# EAGLE design witch-phase2b (EAGLE 6.4)

## Sheet 1 of 6
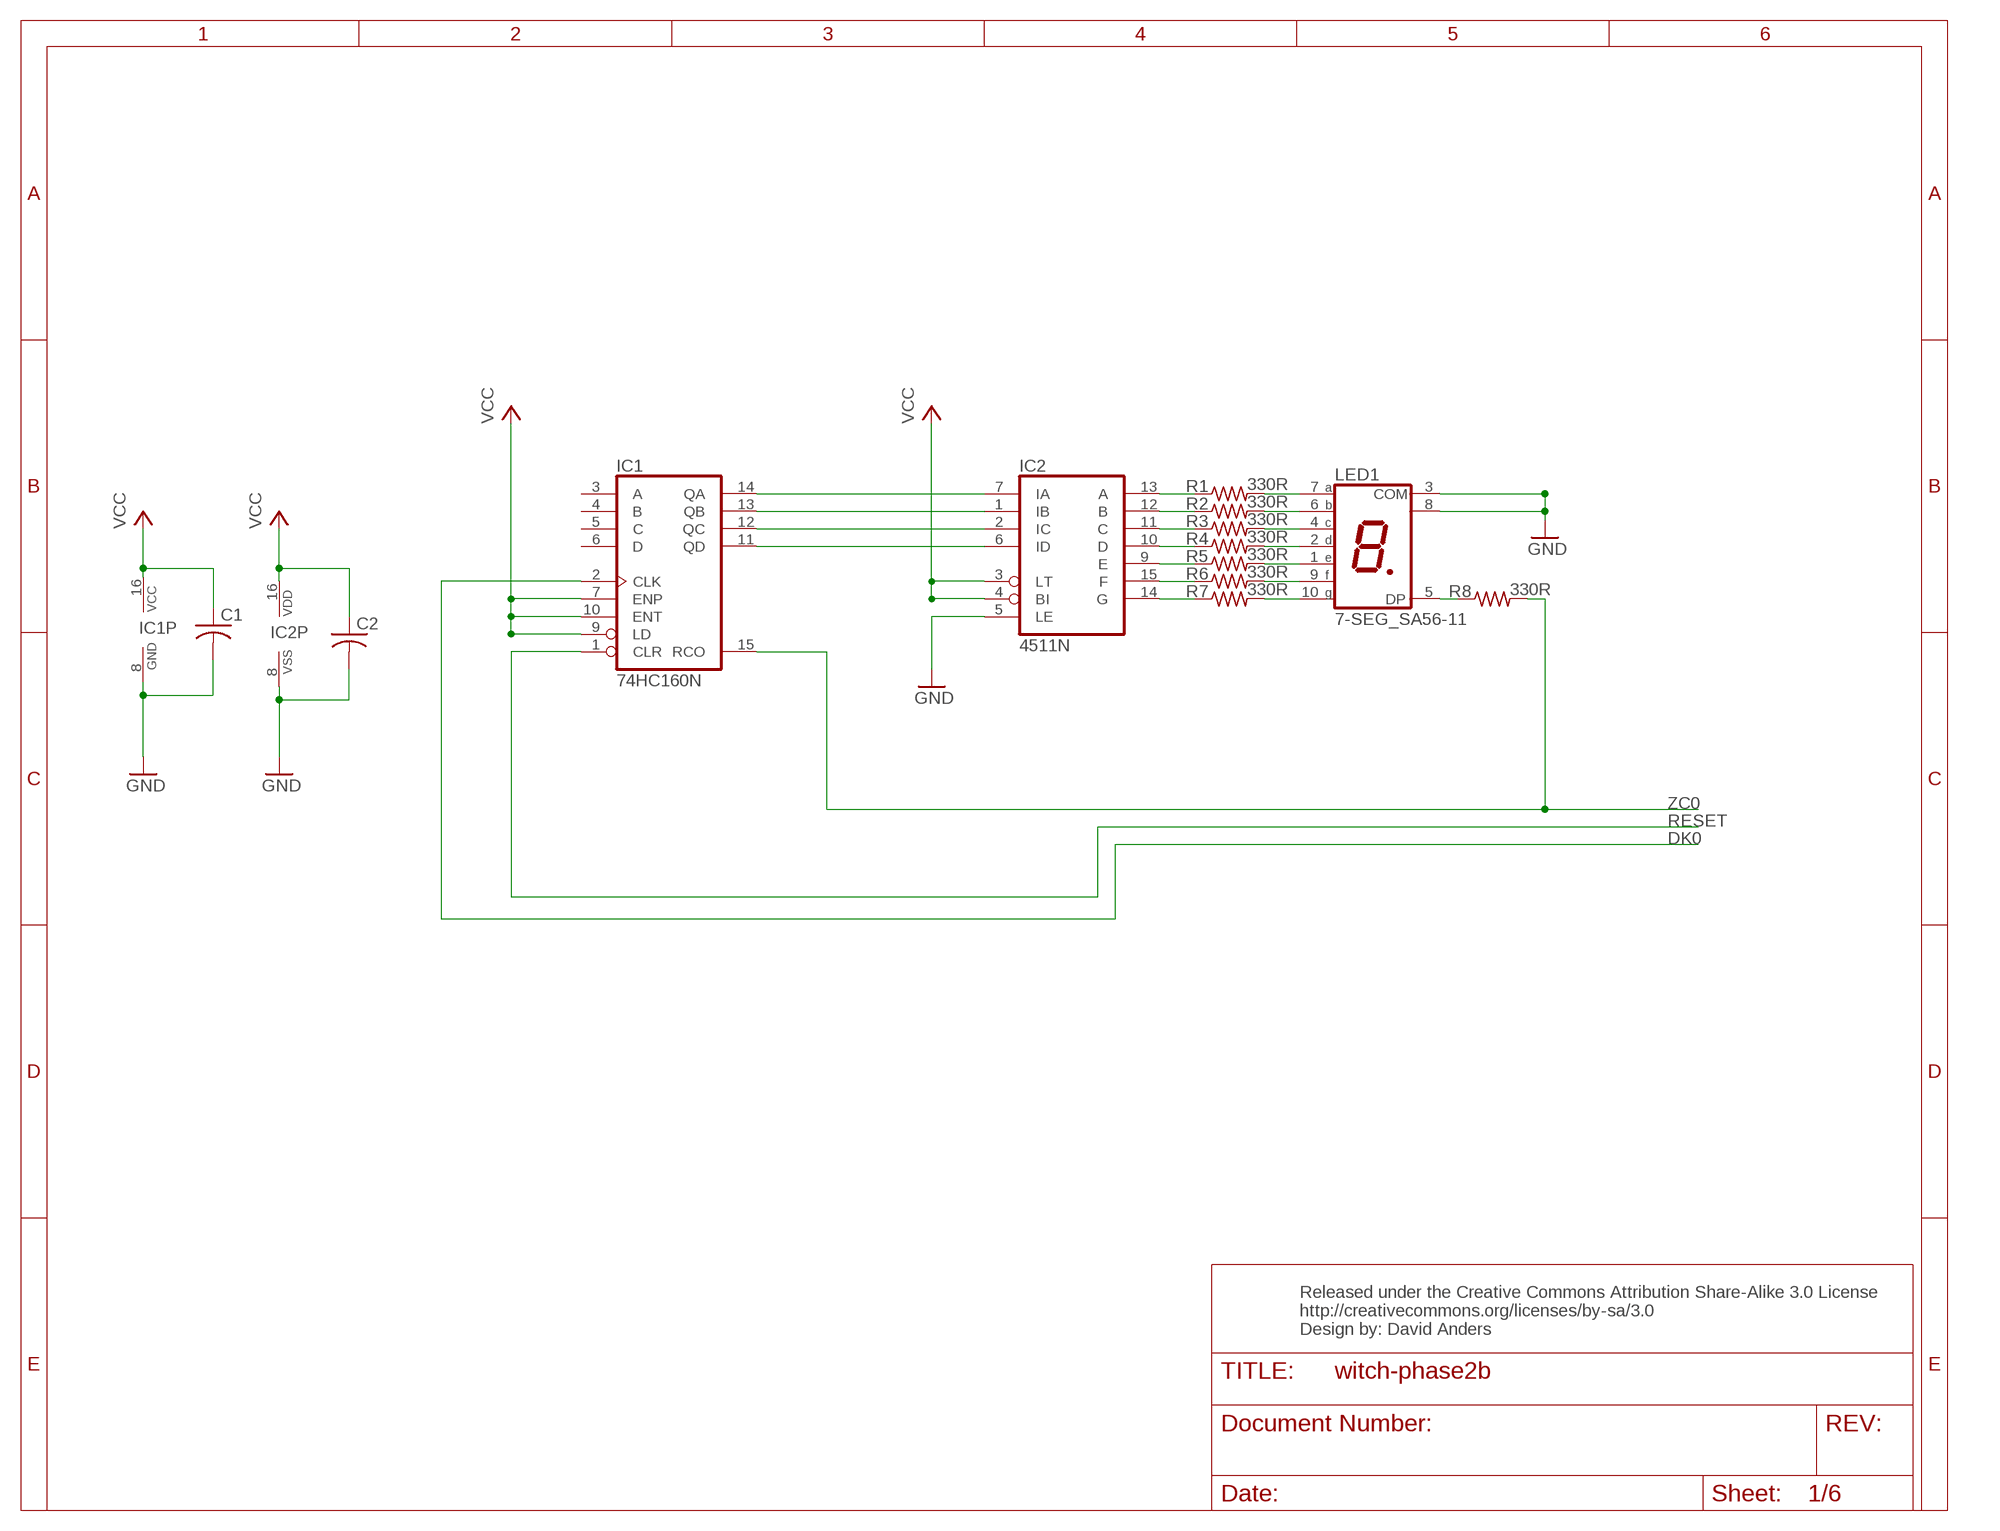
[diagram p0: schematic, sheet 1]

### Parts
C1  C-US025-025X050  [C025-025X050]
C2  C-US025-025X050  [C025-025X050]
IC1  74HC160N  [DIL16]
IC2  4511N  [DIL16]
LED1  7-SEG_SA56-11  [SA56-11]
R1  330R  R-US_0204/5  [0204/5]
R2  330R  R-US_0204/5  [0204/5]
R3  330R  R-US_0204/5  [0204/5]
R4  330R  R-US_0204/5  [0204/5]
R5  330R  R-US_0204/5  [0204/5]
R6  330R  R-US_0204/5  [0204/5]
R7  330R  R-US_0204/5  [0204/5]
R8  330R  R-US_0204/5  [0204/5]

### Nets
DK0: IC1.2(CLK) ; also sheet 5
GND: C1.2 C2.2 IC1.8(GND) IC2.5(LE) IC2.8(VSS) LED1.3(COM) LED1.8(COM) ; also sheet 2,3,4,5,6
N$3: IC2.13(A) R1.1
N$4: IC2.12(B) R2.1
N$5: IC2.11(C) R3.1
N$6: IC2.10(D) R4.1
N$7: IC2.9(E) R5.1
N$8: IC2.15(F) R6.1
N$9: IC2.14(G) R7.1
N$10: IC1.14(QA) IC2.7(IA)
N$11: IC1.13(QB) IC2.1(IB)
N$12: IC1.12(QC) IC2.2(IC)
N$13: IC1.11(QD) IC2.6(ID)
N$14: LED1.7(A) R1.2
N$15: LED1.6(B) R2.2
N$16: LED1.4(C) R3.2
N$17: LED1.2(D) R4.2
N$18: LED1.1(E) R5.2
N$19: LED1.9(F) R6.2
N$20: LED1.10(G) R7.2
N$21: LED1.5(DP) R8.1
RESET: IC1.1(CLR) ; also sheet 2,3,4,6
VCC: C1.1 C2.1 IC1.7(ENP) IC1.9(LD) IC1.10(ENT) IC1.16(VCC) IC2.3(LT) IC2.4(BI) IC2.16(VDD) ; also sheet 2,3,4,5,6
ZC0: IC1.15(RCO) R8.2 ; also sheet 5
Unconnected: IC1.3(A) IC1.4(B) IC1.5(C) IC1.6(D)

### Notes on the sheet
- Released under the Creative Commons Attribution Share-Alike 3.0 License
  http://creativecommons.org/licenses/by-sa/3.0
  Design by: David Anders

## Sheet 2 of 6
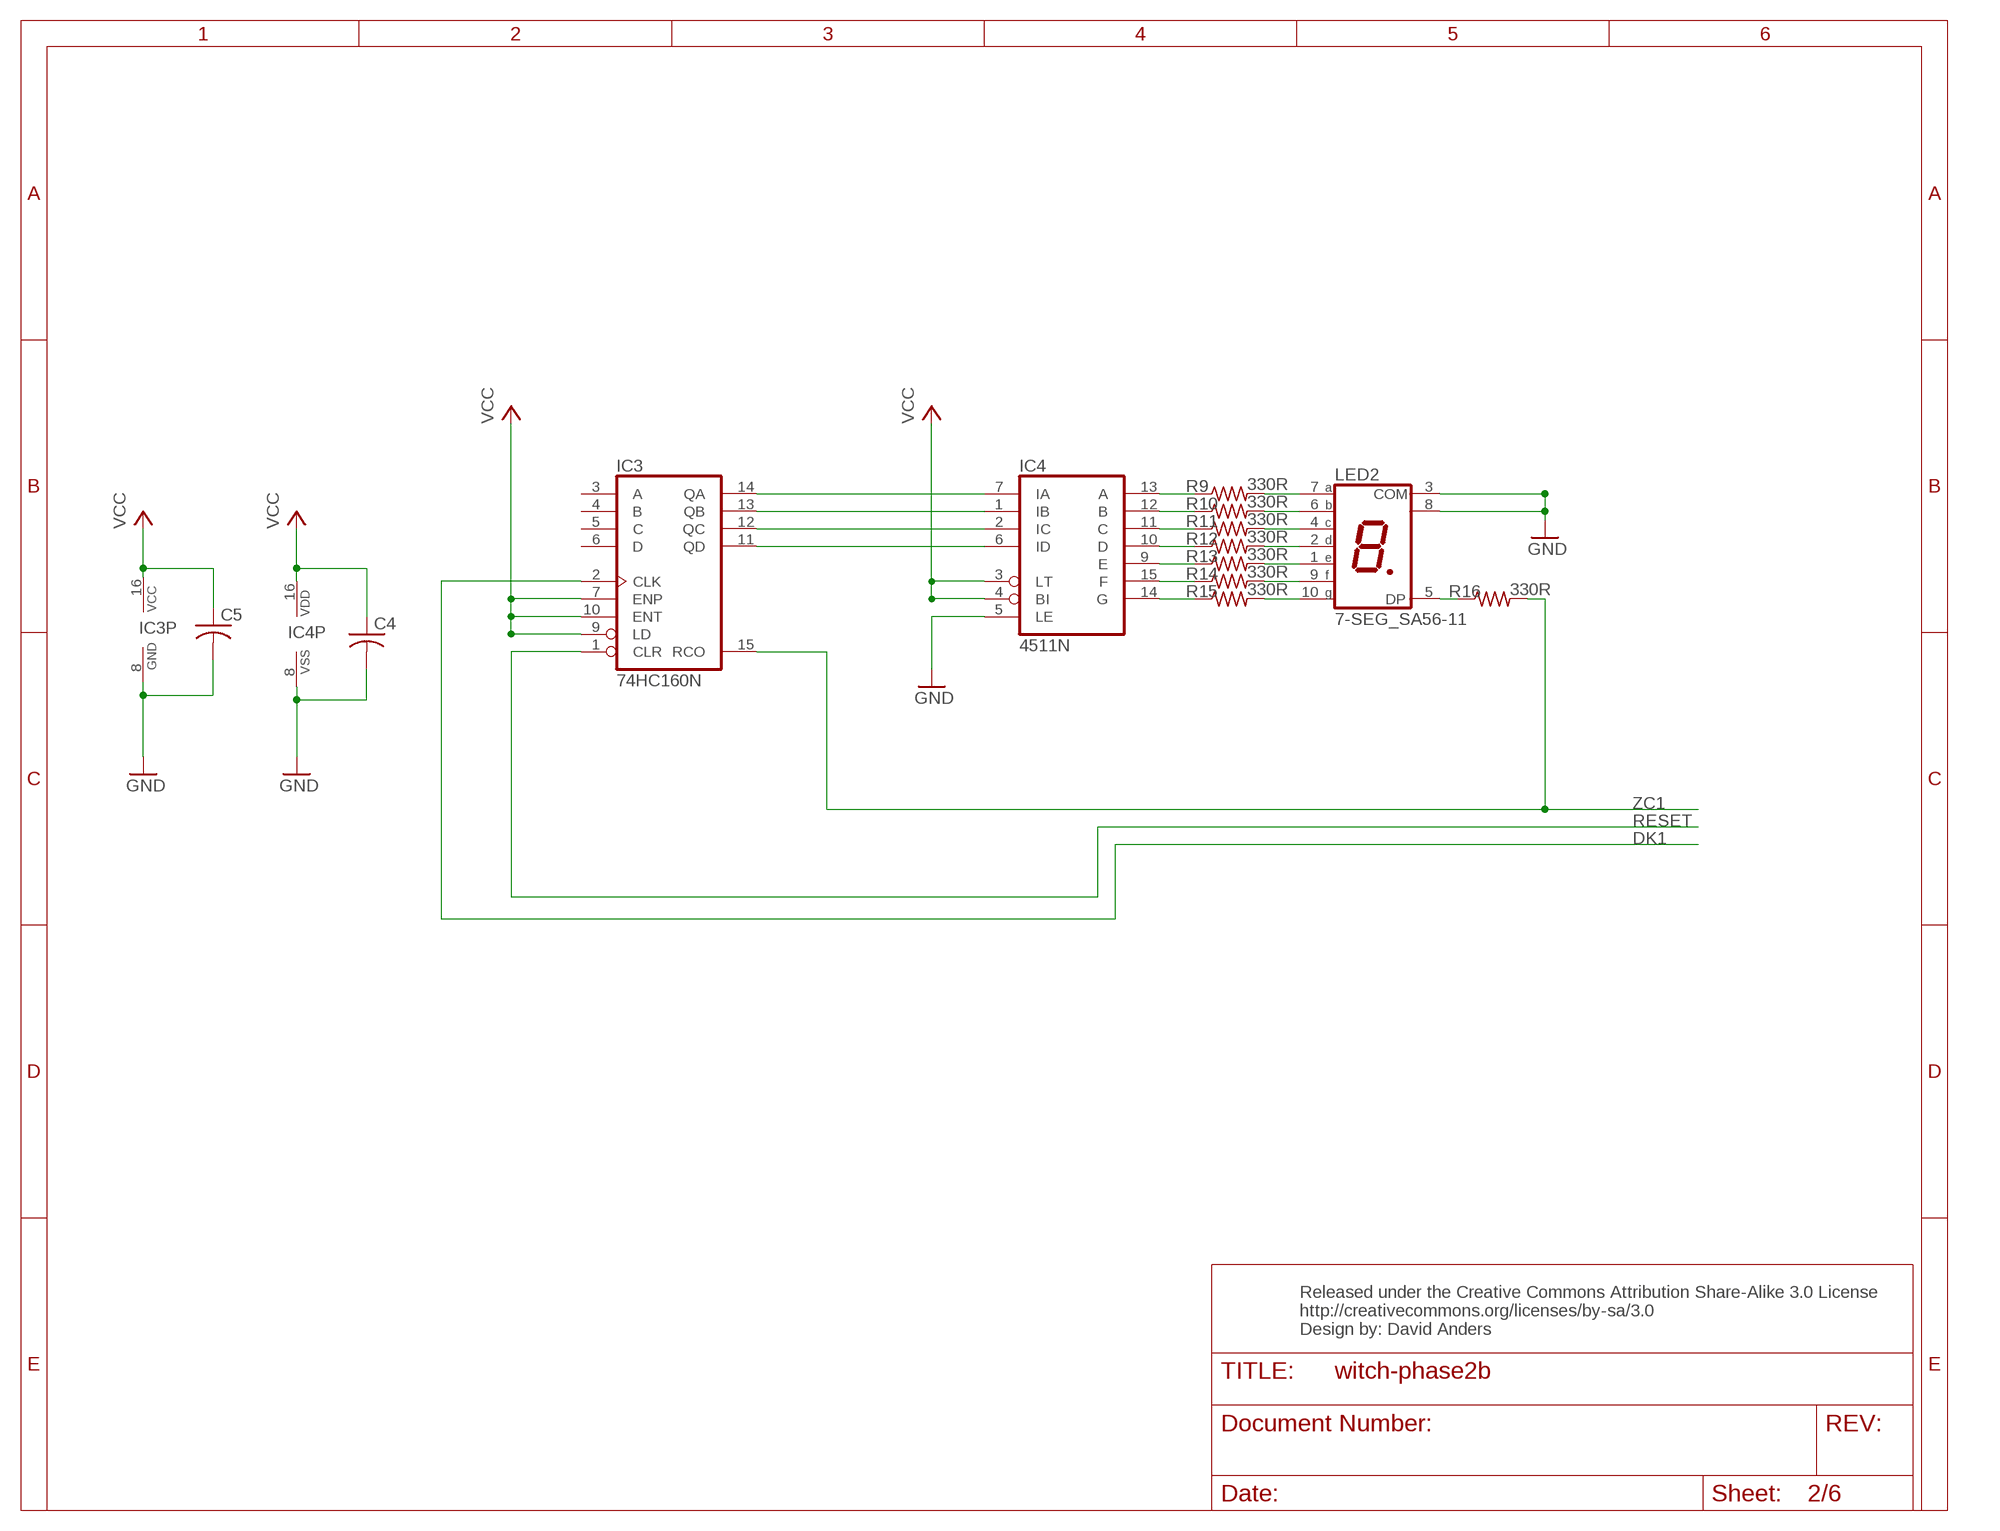
[diagram p1: schematic, sheet 2]

### Parts
C4  C-US025-025X050  [C025-025X050]
C5  C-US025-025X050  [C025-025X050]
IC3  74HC160N  [DIL16]
IC4  4511N  [DIL16]
LED2  7-SEG_SA56-11  [SA56-11]
R9  330R  R-US_0204/5  [0204/5]
R10  330R  R-US_0204/5  [0204/5]
R11  330R  R-US_0204/5  [0204/5]
R12  330R  R-US_0204/5  [0204/5]
R13  330R  R-US_0204/5  [0204/5]
R14  330R  R-US_0204/5  [0204/5]
R15  330R  R-US_0204/5  [0204/5]
R16  330R  R-US_0204/5  [0204/5]

### Nets
DK1: IC3.2(CLK) ; also sheet 5
GND: C4.2 C5.2 IC3.8(GND) IC4.5(LE) IC4.8(VSS) LED2.3(COM) LED2.8(COM) ; also sheet 1,3,4,5,6
N$22: IC3.14(QA) IC4.7(IA)
N$23: IC3.13(QB) IC4.1(IB)
N$24: IC3.12(QC) IC4.2(IC)
N$26: IC3.11(QD) IC4.6(ID)
N$30: IC4.13(A) R9.1
N$31: IC4.12(B) R10.1
N$32: IC4.11(C) R11.1
N$33: IC4.10(D) R12.1
N$34: IC4.9(E) R13.1
N$35: IC4.15(F) R14.1
N$36: IC4.14(G) R15.1
N$37: LED2.7(A) R9.2
N$38: LED2.6(B) R10.2
N$39: LED2.4(C) R11.2
N$40: LED2.2(D) R12.2
N$41: LED2.1(E) R13.2
N$42: LED2.9(F) R14.2
N$43: LED2.10(G) R15.2
N$44: LED2.5(DP) R16.1
RESET: IC3.1(CLR) ; also sheet 1,3,4,6
VCC: C4.1 C5.1 IC3.7(ENP) IC3.9(LD) IC3.10(ENT) IC3.16(VCC) IC4.3(LT) IC4.4(BI) IC4.16(VDD) ; also sheet 1,3,4,5,6
ZC1: IC3.15(RCO) R16.2 ; also sheet 5
Unconnected: IC3.3(A) IC3.4(B) IC3.5(C) IC3.6(D)

### Notes on the sheet
- Released under the Creative Commons Attribution Share-Alike 3.0 License
  http://creativecommons.org/licenses/by-sa/3.0
  Design by: David Anders

## Sheet 3 of 6
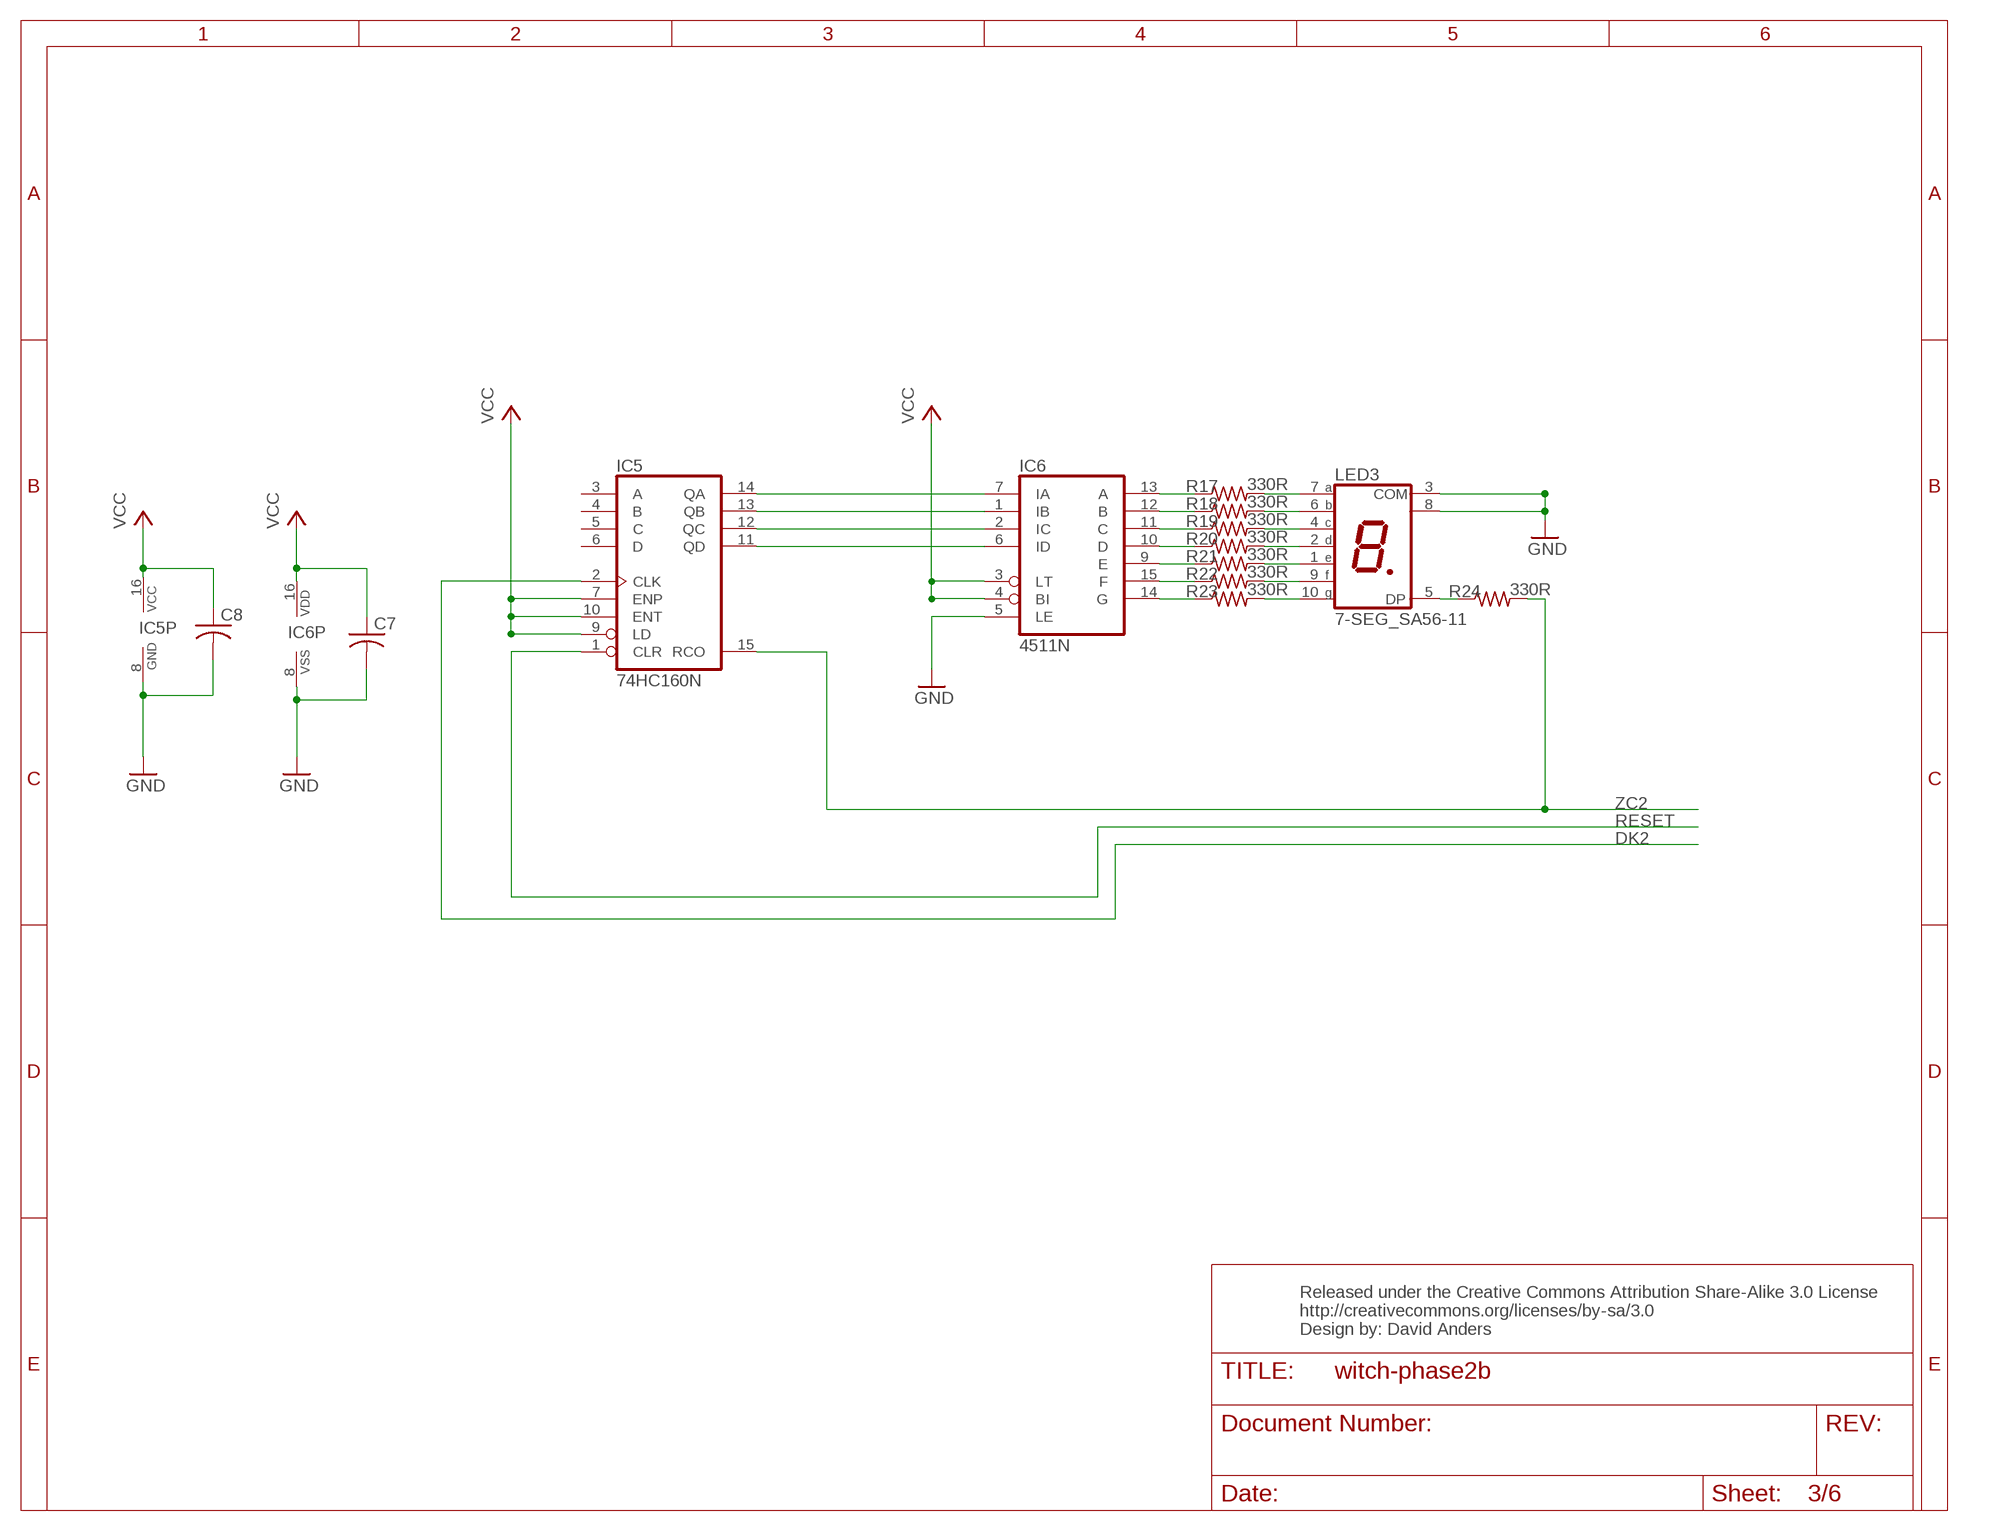
[diagram p2: schematic, sheet 3]

### Parts
C7  C-US025-025X050  [C025-025X050]
C8  C-US025-025X050  [C025-025X050]
IC5  74HC160N  [DIL16]
IC6  4511N  [DIL16]
LED3  7-SEG_SA56-11  [SA56-11]
R17  330R  R-US_0204/5  [0204/5]
R18  330R  R-US_0204/5  [0204/5]
R19  330R  R-US_0204/5  [0204/5]
R20  330R  R-US_0204/5  [0204/5]
R21  330R  R-US_0204/5  [0204/5]
R22  330R  R-US_0204/5  [0204/5]
R23  330R  R-US_0204/5  [0204/5]
R24  330R  R-US_0204/5  [0204/5]

### Nets
DK2: IC5.2(CLK) ; also sheet 5
GND: C7.2 C8.2 IC5.8(GND) IC6.5(LE) IC6.8(VSS) LED3.3(COM) LED3.8(COM) ; also sheet 1,2,4,5,6
N$45: IC5.14(QA) IC6.7(IA)
N$46: IC5.13(QB) IC6.1(IB)
N$47: IC5.12(QC) IC6.2(IC)
N$48: IC5.11(QD) IC6.6(ID)
N$52: IC6.13(A) R17.1
N$53: IC6.12(B) R18.1
N$54: IC6.11(C) R19.1
N$55: IC6.10(D) R20.1
N$56: IC6.9(E) R21.1
N$57: IC6.15(F) R22.1
N$58: IC6.14(G) R23.1
N$59: LED3.7(A) R17.2
N$60: LED3.6(B) R18.2
N$61: LED3.4(C) R19.2
N$62: LED3.2(D) R20.2
N$63: LED3.1(E) R21.2
N$64: LED3.9(F) R22.2
N$65: LED3.10(G) R23.2
N$66: LED3.5(DP) R24.1
RESET: IC5.1(CLR) ; also sheet 1,2,4,6
VCC: C7.1 C8.1 IC5.7(ENP) IC5.9(LD) IC5.10(ENT) IC5.16(VCC) IC6.3(LT) IC6.4(BI) IC6.16(VDD) ; also sheet 1,2,4,5,6
ZC2: IC5.15(RCO) R24.2 ; also sheet 5
Unconnected: IC5.3(A) IC5.4(B) IC5.5(C) IC5.6(D)

### Notes on the sheet
- Released under the Creative Commons Attribution Share-Alike 3.0 License
  http://creativecommons.org/licenses/by-sa/3.0
  Design by: David Anders

## Sheet 4 of 6
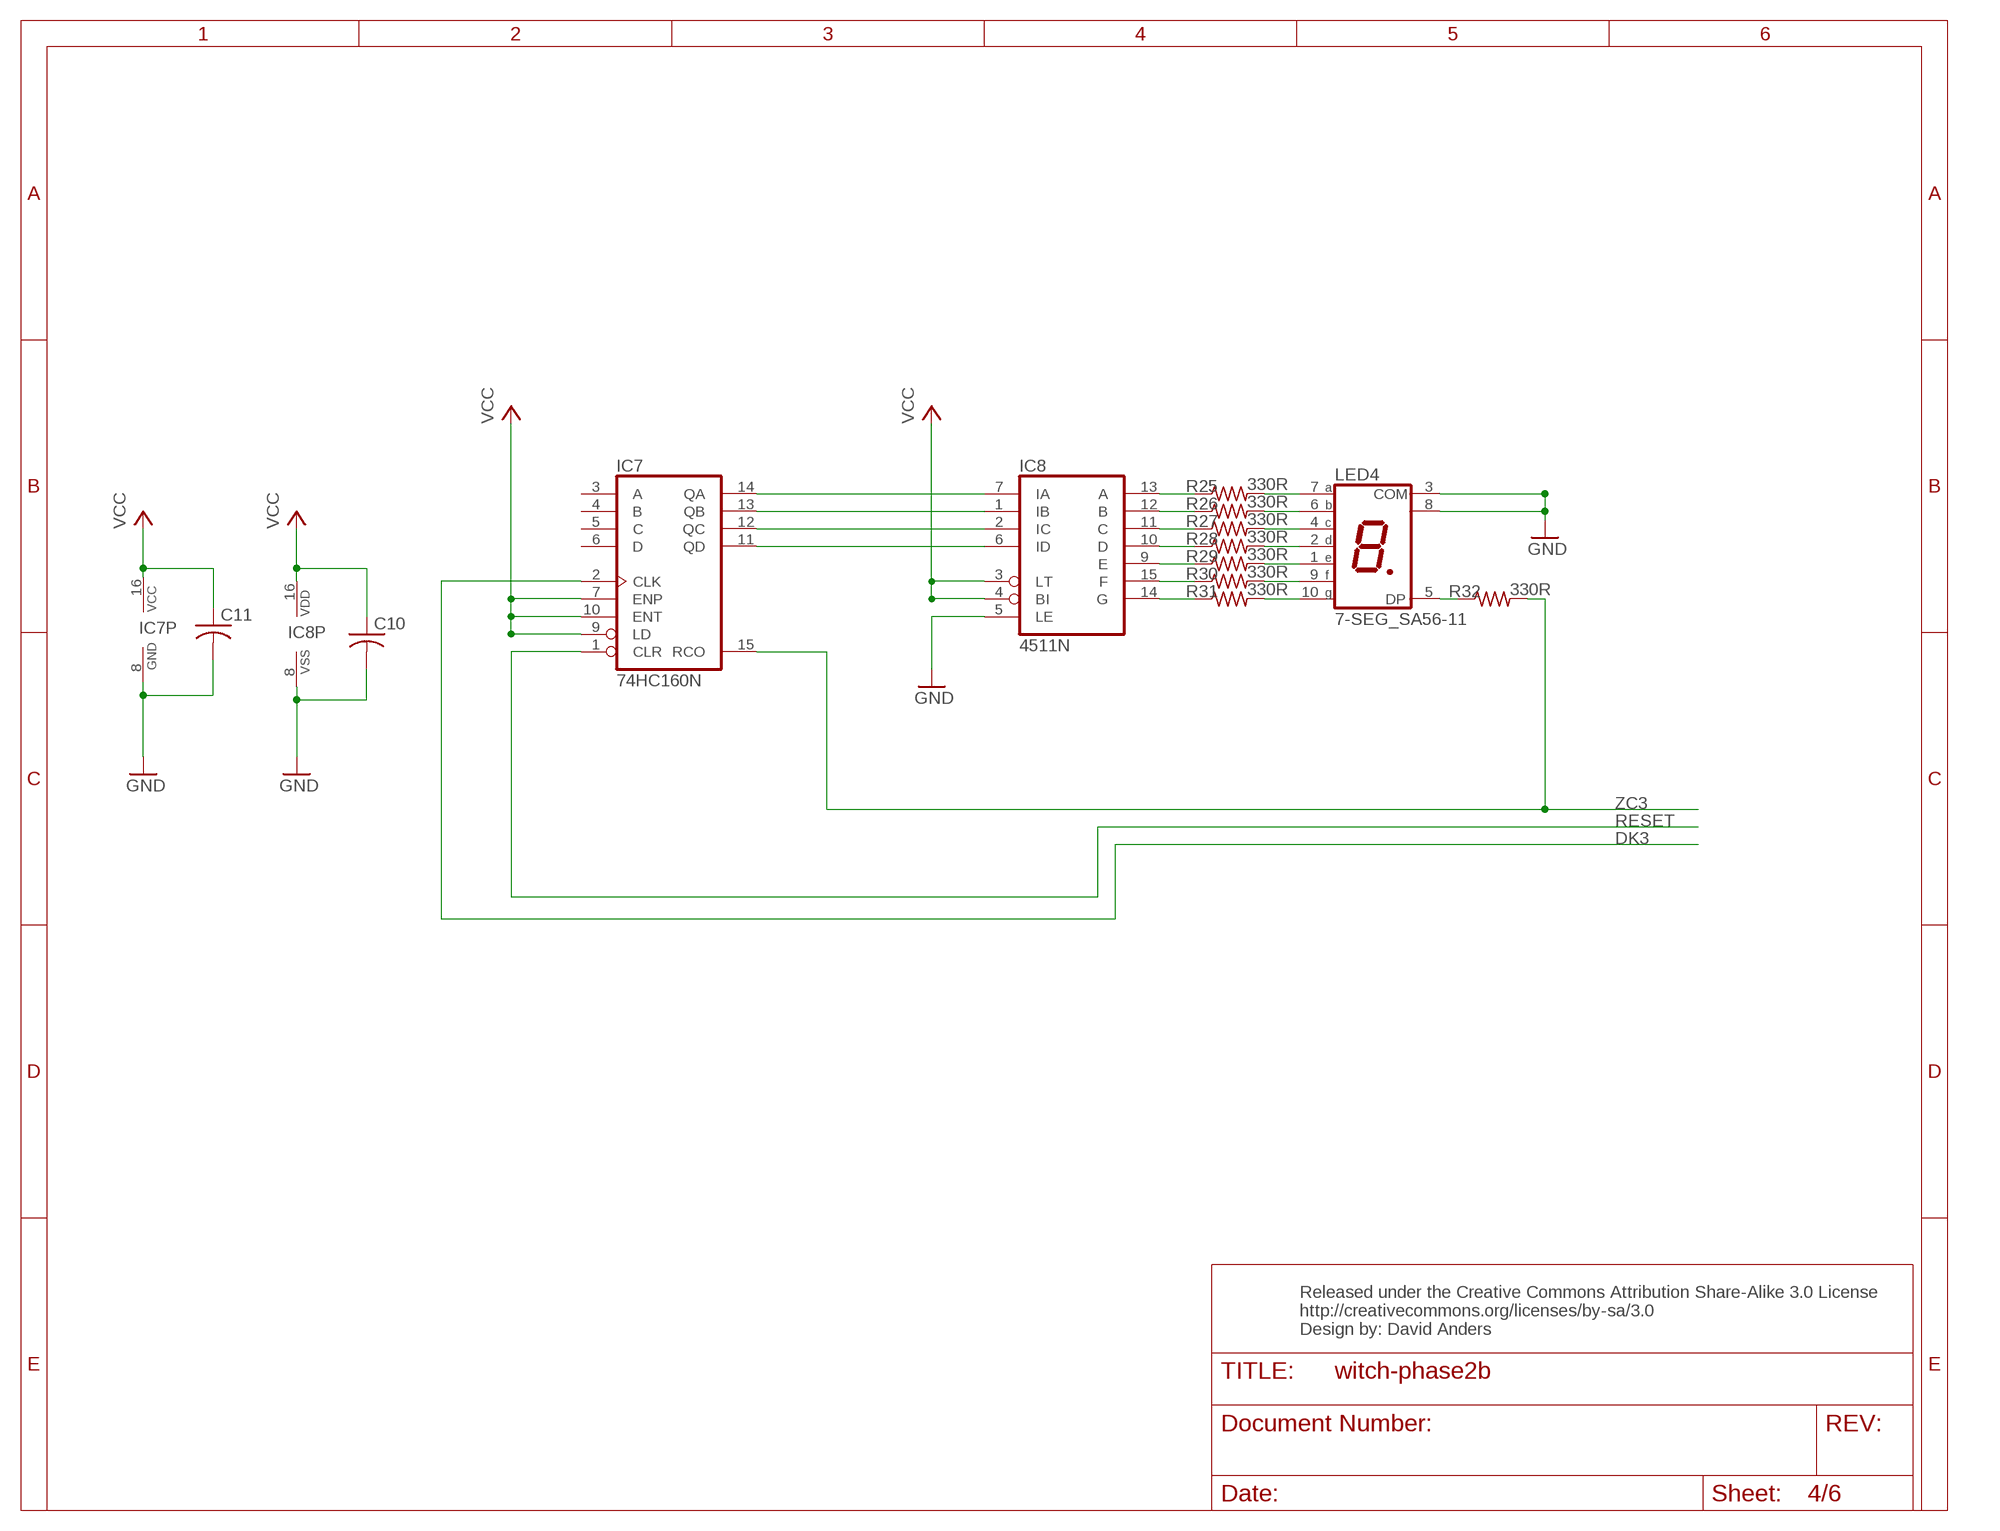
[diagram p3: schematic, sheet 4]

### Parts
C10  C-US025-025X050  [C025-025X050]
C11  C-US025-025X050  [C025-025X050]
IC7  74HC160N  [DIL16]
IC8  4511N  [DIL16]
LED4  7-SEG_SA56-11  [SA56-11]
R25  330R  R-US_0204/5  [0204/5]
R26  330R  R-US_0204/5  [0204/5]
R27  330R  R-US_0204/5  [0204/5]
R28  330R  R-US_0204/5  [0204/5]
R29  330R  R-US_0204/5  [0204/5]
R30  330R  R-US_0204/5  [0204/5]
R31  330R  R-US_0204/5  [0204/5]
R32  330R  R-US_0204/5  [0204/5]

### Nets
DK3: IC7.2(CLK) ; also sheet 5
GND: C10.2 C11.2 IC7.8(GND) IC8.5(LE) IC8.8(VSS) LED4.3(COM) LED4.8(COM) ; also sheet 1,2,3,5,6
N$67: IC7.14(QA) IC8.7(IA)
N$68: IC7.13(QB) IC8.1(IB)
N$69: IC7.12(QC) IC8.2(IC)
N$70: IC7.11(QD) IC8.6(ID)
N$74: IC8.13(A) R25.1
N$75: IC8.12(B) R26.1
N$76: IC8.11(C) R27.1
N$77: IC8.10(D) R28.1
N$78: IC8.9(E) R29.1
N$79: IC8.15(F) R30.1
N$80: IC8.14(G) R31.1
N$81: LED4.7(A) R25.2
N$82: LED4.6(B) R26.2
N$83: LED4.4(C) R27.2
N$84: LED4.2(D) R28.2
N$85: LED4.1(E) R29.2
N$86: LED4.9(F) R30.2
N$87: LED4.10(G) R31.2
N$88: LED4.5(DP) R32.1
RESET: IC7.1(CLR) ; also sheet 1,2,3,6
VCC: C10.1 C11.1 IC7.7(ENP) IC7.9(LD) IC7.10(ENT) IC7.16(VCC) IC8.3(LT) IC8.4(BI) IC8.16(VDD) ; also sheet 1,2,3,5,6
ZC3: IC7.15(RCO) R32.2 ; also sheet 5
Unconnected: IC7.3(A) IC7.4(B) IC7.5(C) IC7.6(D)

### Notes on the sheet
- Released under the Creative Commons Attribution Share-Alike 3.0 License
  http://creativecommons.org/licenses/by-sa/3.0
  Design by: David Anders

## Sheet 5 of 6
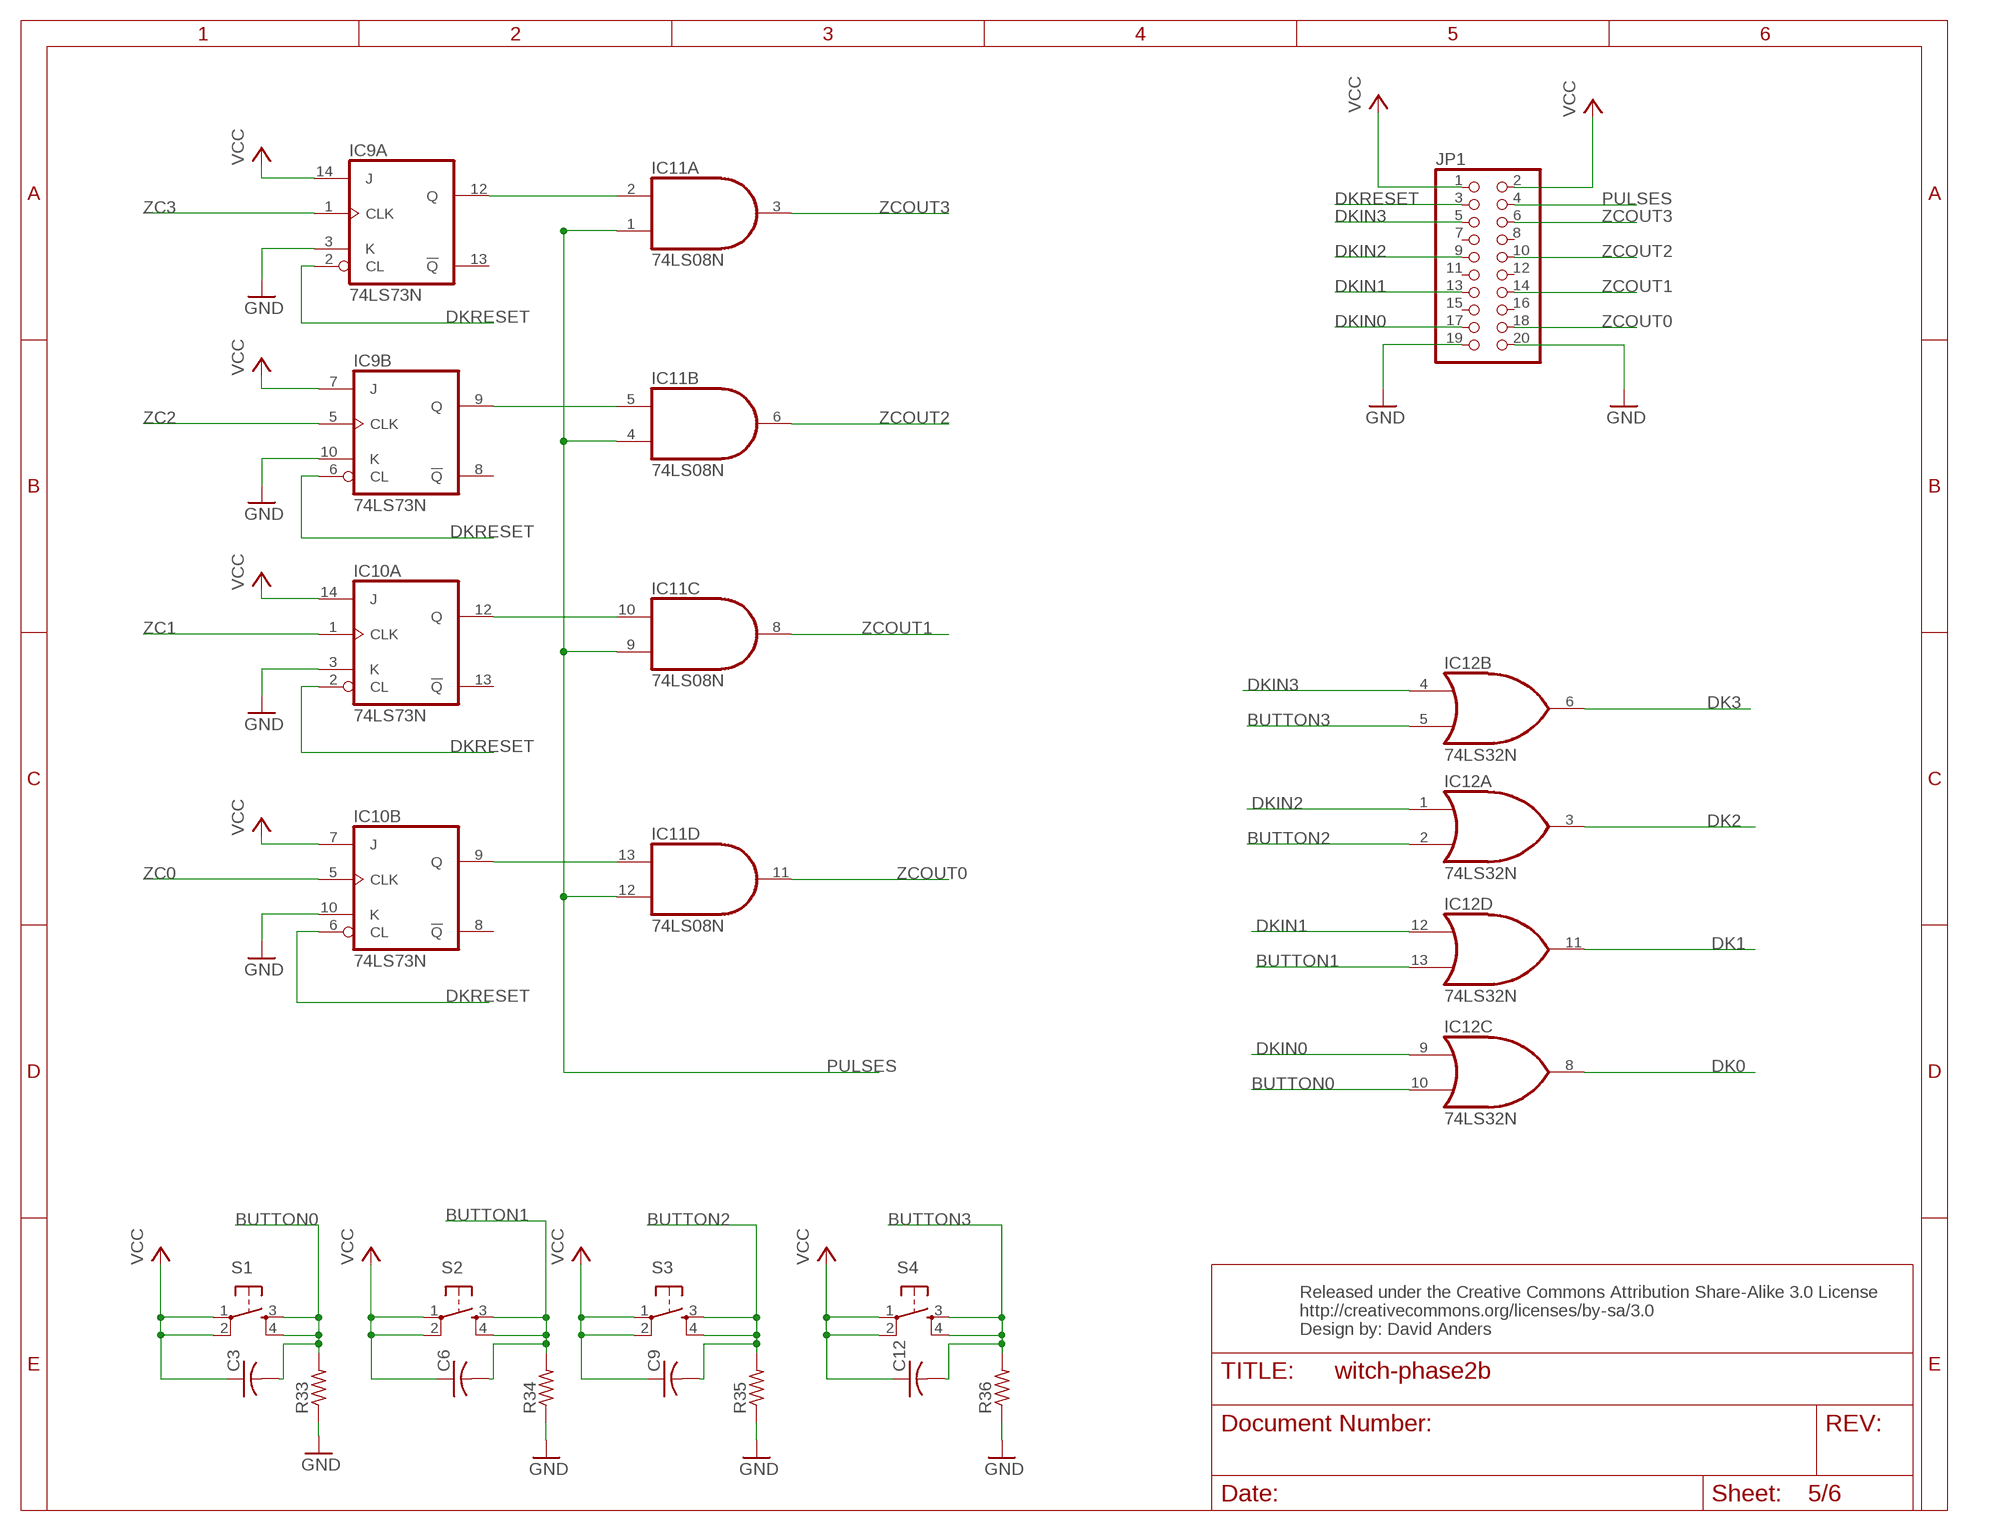
[diagram p4: schematic, sheet 5]

### Parts
C3  C-US025-025X050  [C025-025X050]
C6  C-US025-025X050  [C025-025X050]
C9  C-US025-025X050  [C025-025X050]
C12  C-US025-025X050  [C025-025X050]
IC9  74LS73N  [DIL14]
IC10  74LS73N  [DIL14]
IC11  74LS08N  [DIL14]
IC12  74LS32N  [DIL14]
JP1  PINHD-2X10  [2X10]
R33  R-US_0204/5  [0204/5]
R34  R-US_0204/5  [0204/5]
R35  R-US_0204/5  [0204/5]
R36  R-US_0204/5  [0204/5]
S1  TAC_SWITCHPTH  [TACTILE-PTH]
S2  TAC_SWITCHPTH  [TACTILE-PTH]
S3  TAC_SWITCHPTH  [TACTILE-PTH]
S4  TAC_SWITCHPTH  [TACTILE-PTH]

### Nets
BUTTON0: C3.2 IC12.10(C:I1) R33.2 S1.3 S1.4
BUTTON1: C6.2 IC12.13(D:I1) R34.2 S2.3 S2.4
BUTTON2: C9.2 IC12.2(A:I1) R35.2 S3.3 S3.4
BUTTON3: C12.2 IC12.5(B:I1) R36.2 S4.3 S4.4
DK0: IC12.8(C:O) ; also sheet 1
DK1: IC12.11(D:O) ; also sheet 2
DK2: IC12.3(A:O) ; also sheet 3
DK3: IC12.6(B:O) ; also sheet 4
DKIN0: IC12.9(C:I0) JP1.17
DKIN1: IC12.12(D:I0) JP1.13
DKIN2: IC12.1(A:I0) JP1.9
DKIN3: IC12.4(B:I0) JP1.5
DKRESET: IC9.2(A:CL) IC9.6(B:CL) IC10.2(A:CL) IC10.6(B:CL) JP1.3
GND: IC9.3(A:K) IC9.10(B:K) IC10.3(A:K) IC10.10(B:K) JP1.19 JP1.20 R33.1 R34.1 R35.1 R36.1 ; also sheet 1,2,3,4,6
N$1: IC9.12(A:Q) IC11.2(A:I1)
N$2: IC9.9(B:Q) IC11.5(B:I1)
N$25: IC10.12(A:Q) IC11.10(C:I1)
N$27: IC10.9(B:Q) IC11.13(D:I1)
PULSES: IC11.1(A:I0) IC11.4(B:I0) IC11.9(C:I0) IC11.12(D:I0) JP1.4
VCC: C3.1 IC9.7(B:J) IC9.14(A:J) IC10.7(B:J) IC10.14(A:J) JP1.1 JP1.2 S1.1 S1.2 S2.1 S2.2 S3.1 S3.2 S4.1 S4.2 ; also sheet 1,2,3,4,6
VCC1: C6.1
VCC2: C9.1
VCC3: C12.1
ZC0: IC10.5(B:CLK) ; also sheet 1
ZC1: IC10.1(A:CLK) ; also sheet 2
ZC2: IC9.5(B:CLK) ; also sheet 3
ZC3: IC9.1(A:CLK) ; also sheet 4
ZCOUT0: IC11.11(D:O) JP1.18
ZCOUT1: IC11.8(C:O) JP1.14
ZCOUT2: IC11.6(B:O) JP1.10
ZCOUT3: IC11.3(A:O) JP1.6
Unconnected: IC9.8(B:!Q) IC9.13(A:!Q) IC10.8(B:!Q) IC10.13(A:!Q) JP1.7 JP1.8 JP1.11 JP1.12 JP1.15 JP1.16

### Notes on the sheet
- Released under the Creative Commons Attribution Share-Alike 3.0 License
  http://creativecommons.org/licenses/by-sa/3.0
  Design by: David Anders

## Sheet 6 of 6
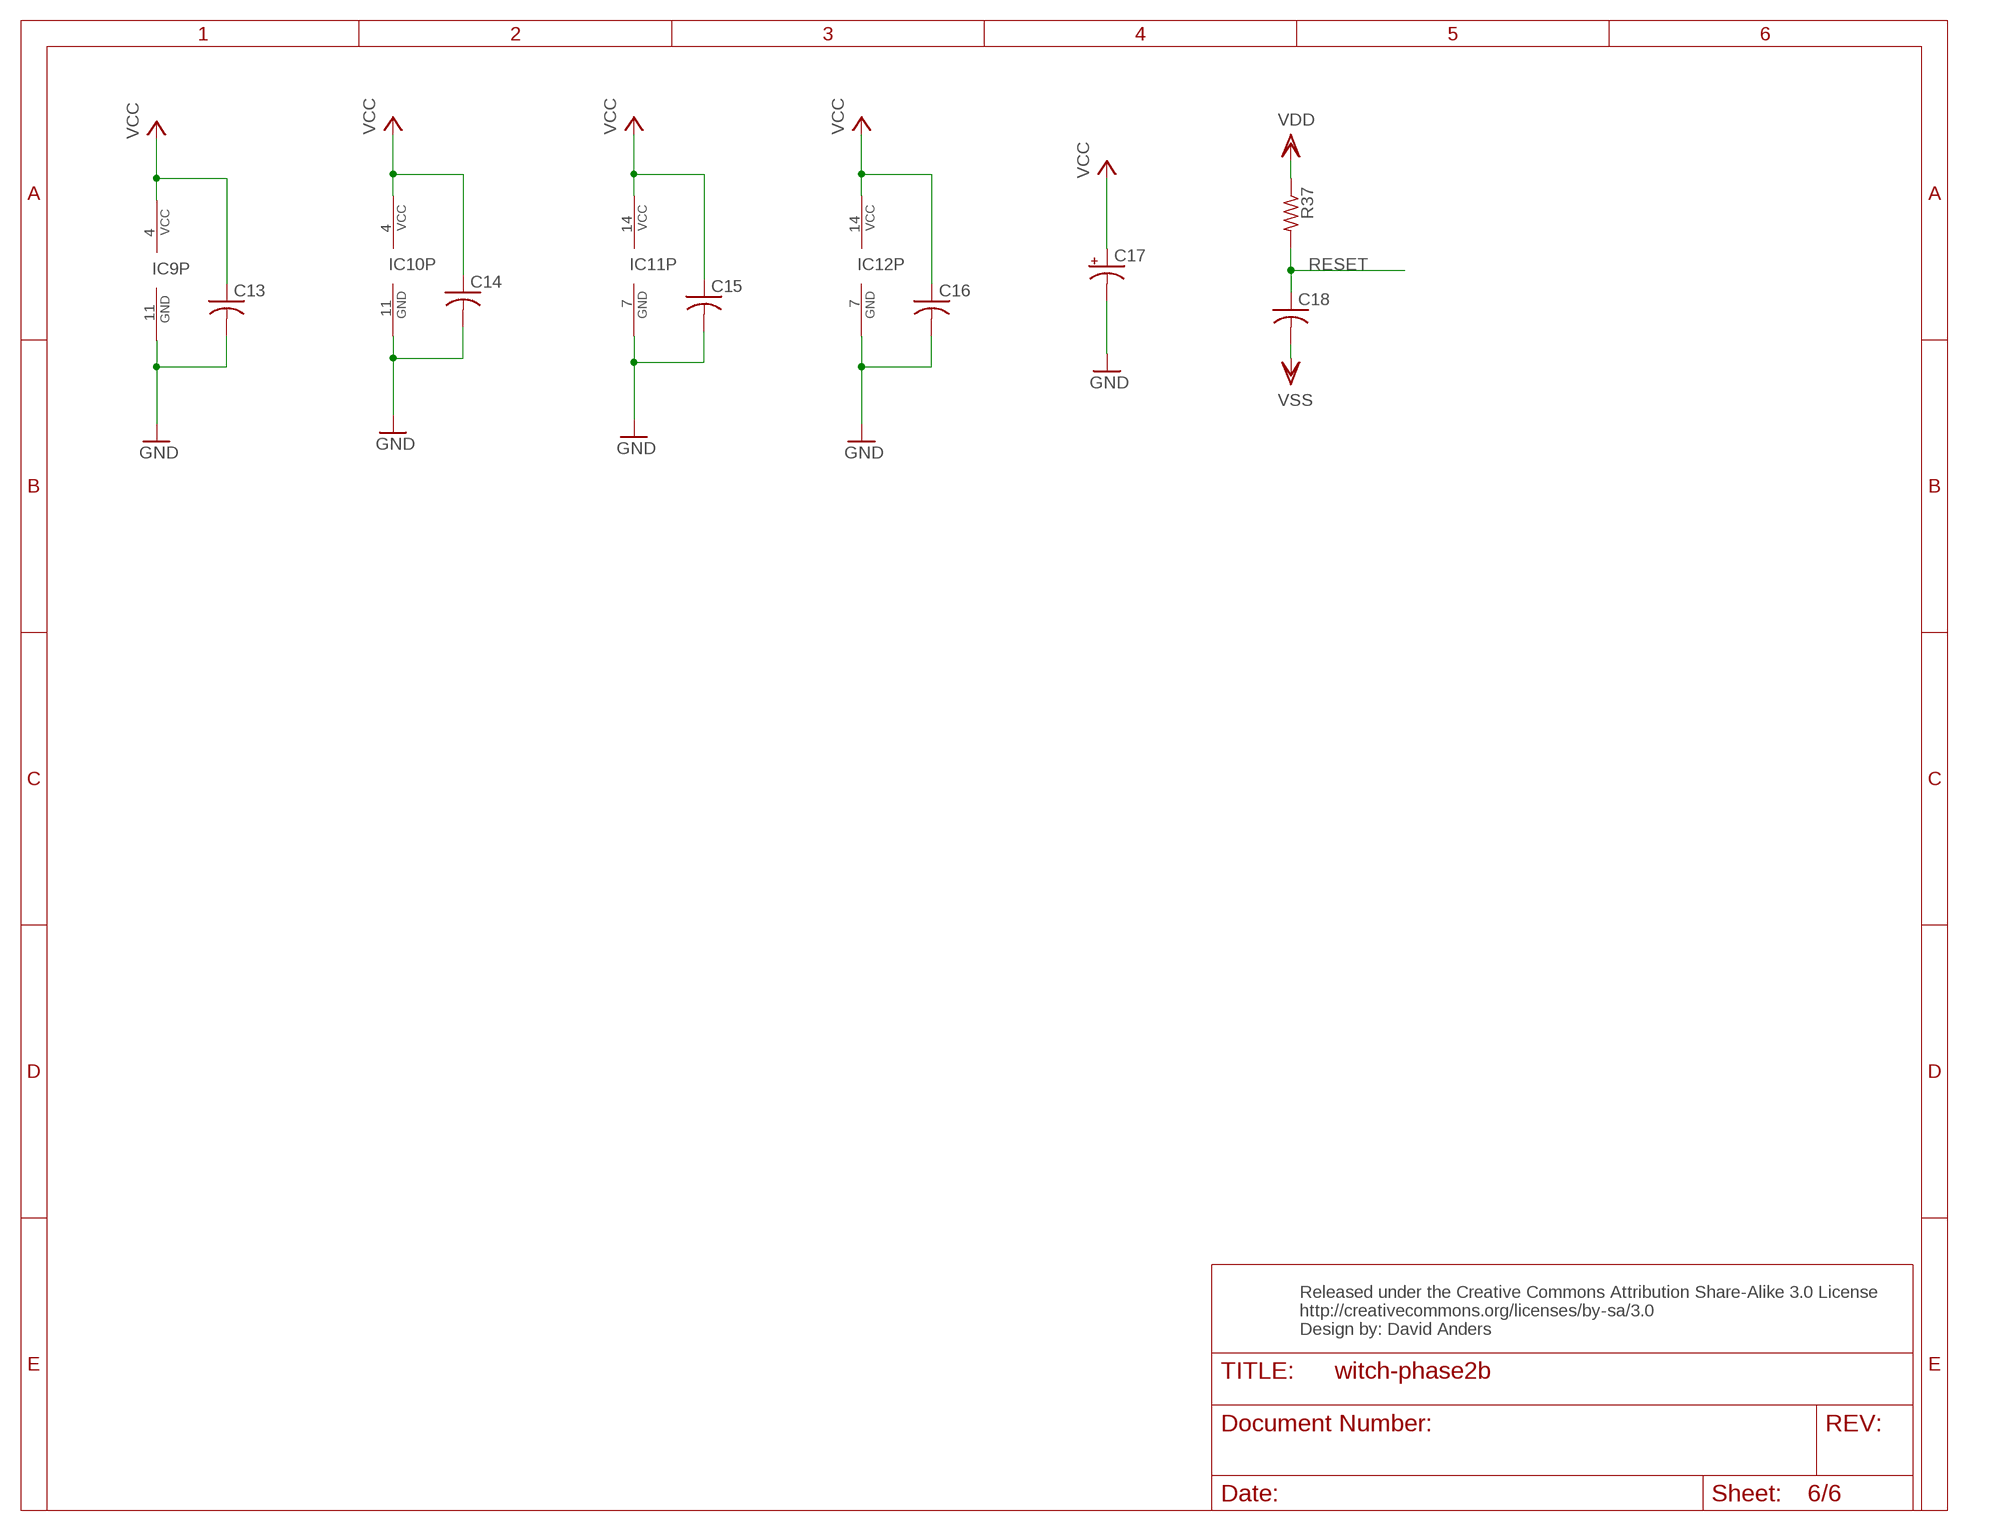
[diagram p5: schematic, sheet 6]

### Parts
C13  C-US025-025X050  [C025-025X050]
C14  C-US025-025X050  [C025-025X050]
C15  C-US025-025X050  [C025-025X050]
C16  C-US025-025X050  [C025-025X050]
C17  CPOL-USE2-5  [E2-5]
C18  C-US025-040X050  [C025-040X050]
R37  R-US_0204/5  [0204/5]

### Nets
GND: C13.2 C14.2 C15.2 C16.2 C17.- IC9.11(P:GND) IC10.11(P:GND) IC11.7(P:GND) IC12.7(P:GND) ; also sheet 1,2,3,4,5
RESET: C18.1 R37.2 ; also sheet 1,2,3,4
VCC: C13.1 C14.1 C15.1 C16.1 C17.+ IC9.4(P:VCC) IC10.4(P:VCC) IC11.14(P:VCC) IC12.14(P:VCC) ; also sheet 1,2,3,4,5
VDD: R37.1
VSS: C18.2

### Notes on the sheet
- Released under the Creative Commons Attribution Share-Alike 3.0 License
  http://creativecommons.org/licenses/by-sa/3.0
  Design by: David Anders

## Library data of the parts
C1-C16 C18 = resistor:C-US: CAPACITOR, American symbol
C17 = resistor:CPOL-US: POLARIZED CAPACITOR, American symbol
IC1 IC3 IC5 IC7 = 74xx-eu:74*160: Synchronous 4-bit COUNTER
IC2 IC4 IC6 IC8 = 45xx:4511: BCD to 7-segment LATCH/DECODER/DRIVER
IC9 IC10 = 74xx-us:74*73: Dual J-K FLIP FLOP, clear
IC11 = 74xx-us:74*08: Quad 2-input AND gate
IC12 = 74xx-us:74*32: Quad 2-input OR gate
JP1 = pinhead:PINHD-2X10: PIN HEADER
LED1-LED4 = display-kingbright:7-SEG_: Kingbright 14.2mm (0.56 INCH) SINGLE DIGIT NUMERIC DUISPLAY Source: SA56-11EWA(Ver1189471036.pdf; OC_FARNELL: unknown; OC_NEWARK: unknown
R1-R37 = resistor:R-US_: RESISTOR, American symbol
S1-S4 = SparkFun-Electromechanical:TAC_SWITCH: Momentary Switch Button commonly used for reset or general input. Spark Fun Electronics SKU : COM-00097 SMT- SWCH-08247

## Board
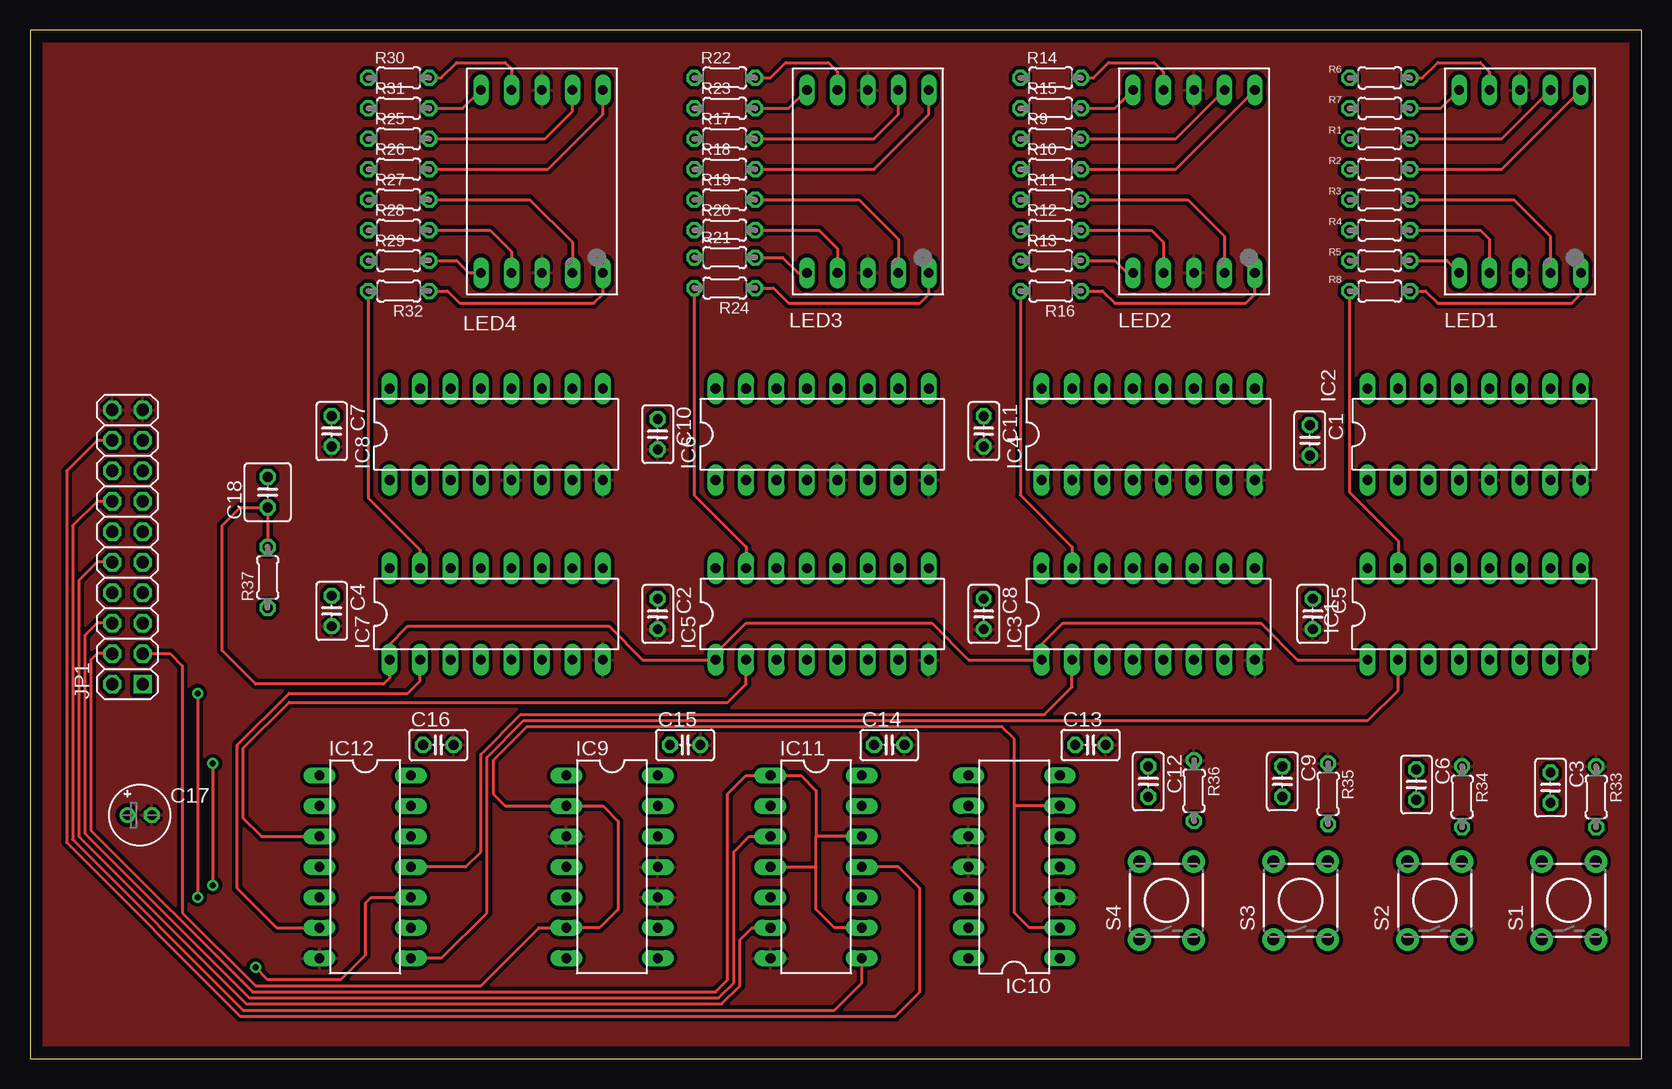
[diagram p6: board, top side]
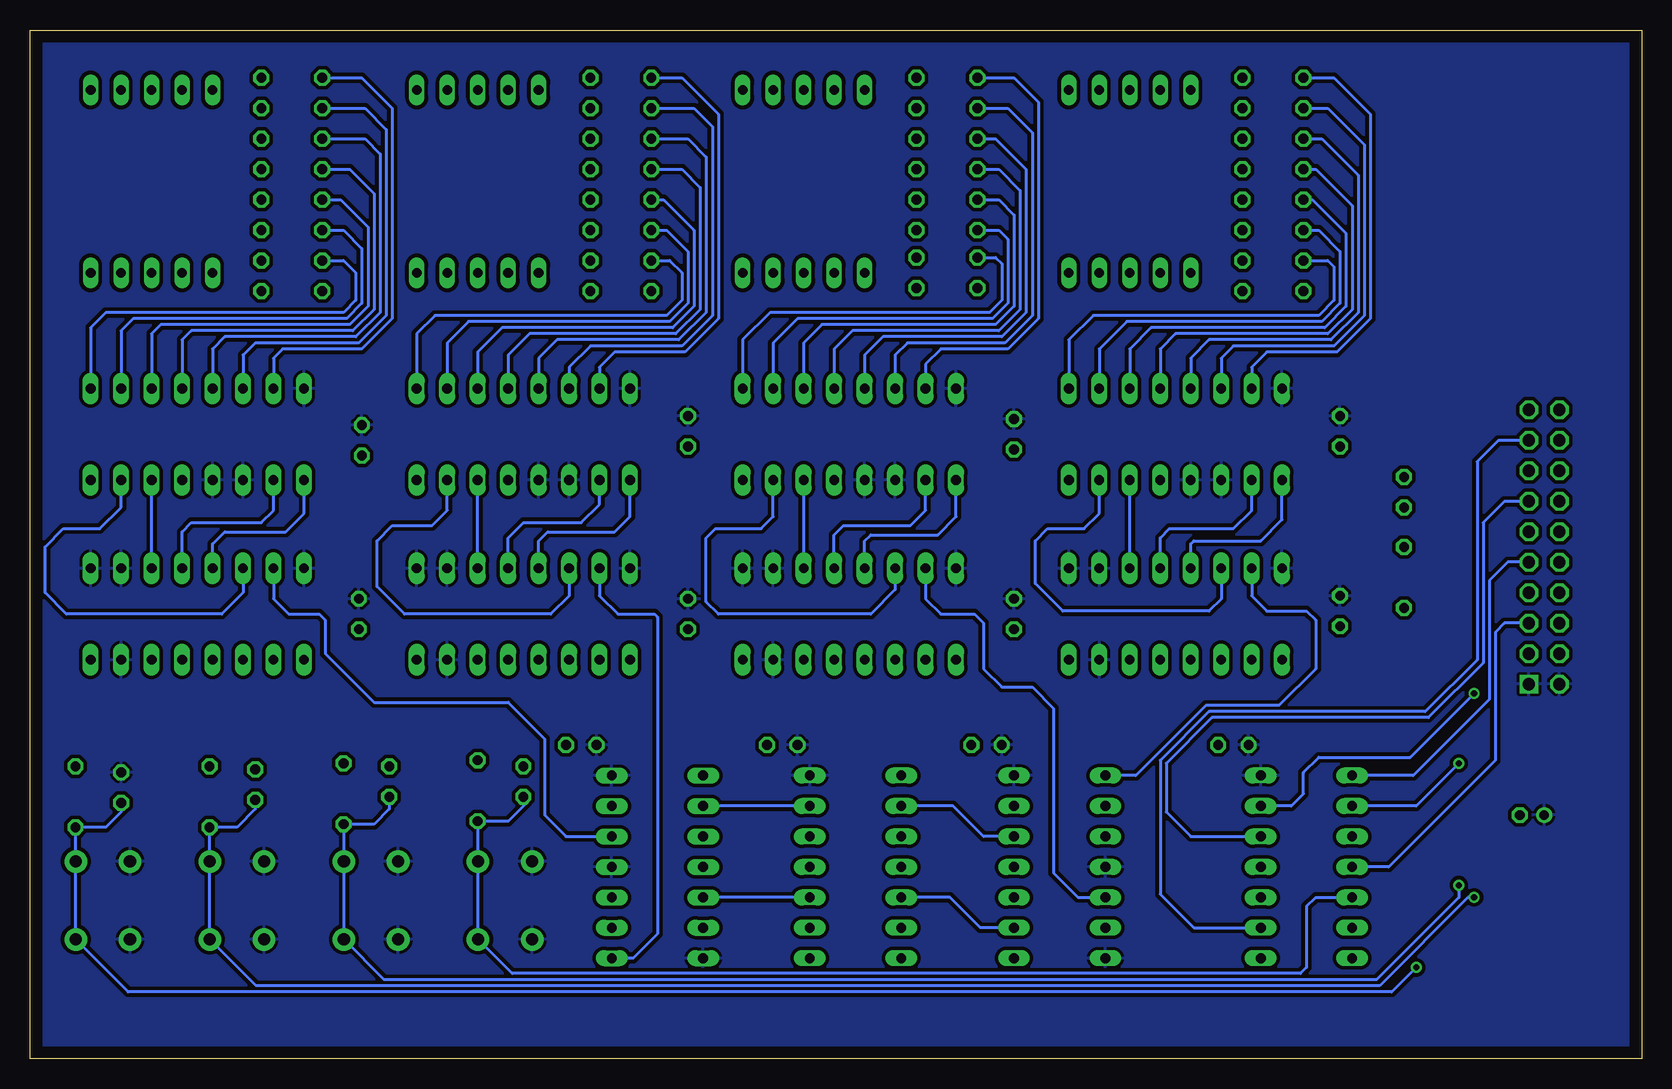
[diagram p7: board, bottom side, seen from below]

Size 134.35 x 85.78 mm. Coordinates in mm from the lower left corner, seen from the top.
Outline: 0,0 134.35,0 134.35,85.78 0,85.78 0,0
Copper layers (1*16): Top 0.035mm / dielectric 1.5mm / Bottom 0.035mm
Design rules "default *": minimum track width 10mil, minimum drill 20mil, track to track 8mil, track to pad 8mil, pad to pad 8mil, via to via 8mil, smd to smd 8mil, copper to edge 40mil, drill to drill 8mil, minimum pad ring 10mil, minimum via ring 8mil, stop-mask expansion 4mil, vias tented up to drill 0mil, thermal gap 10mil

### Footprints (pad centres in the part's own frame; a part is rotated, then mirrored left to right if it is on the bottom)
C025-025X050 = drill 0.813 octagon: 1 -1.27,0; 2 1.27,0
E2-5 = drill 0.813 pad 1.27: + -1.016,0 | drill 0.813 pad 1.27 octagon: - 1.016,0
C025-040X050 = drill 0.813 octagon: 1 -1.27,0; 2 1.27,0
DIL16 = drill 0.813 long: 1 -8.89,-3.81; 2 -6.35,-3.81; 3 -3.81,-3.81; 4 -1.27,-3.81; 5 1.27,-3.81; 6 3.81,-3.81; 7 6.35,-3.81; 8 8.89,-3.81; 9 8.89,3.81; 10 6.35,3.81; 11 3.81,3.81; 12 1.27,3.81; 13 -1.27,3.81; 14 -3.81,3.81; 15 -6.35,3.81; 16 -8.89,3.81
DIL14 = drill 0.813 long: 1 -7.62,-3.81; 2 -5.08,-3.81; 3 -2.54,-3.81; 4 0,-3.81; 5 2.54,-3.81; 6 5.08,-3.81; 7 7.62,-3.81; 8 7.62,3.81; 9 5.08,3.81; 10 2.54,3.81; 11 0,3.81; 12 -2.54,3.81; 13 -5.08,3.81; 14 -7.62,3.81
2X10 = drill 1.016 square: 1 -11.43,-1.27 | drill 1.016 octagon: 2 -11.43,1.27; 3 -8.89,-1.27; 4 -8.89,1.27; 5 -6.35,-1.27; 6 -6.35,1.27; 7 -3.81,-1.27; 8 -3.81,1.27; 9 -1.27,-1.27; 10 -1.27,1.27; 11 1.27,-1.27; 12 1.27,1.27; 13 3.81,-1.27; 14 3.81,1.27; 15 6.35,-1.27; 16 6.35,1.27; 17 8.89,-1.27; 18 8.89,1.27; 19 11.43,-1.27; 20 11.43,1.27
SA56-11 = drill 0.8 long: 1 -5.08,-7.62; 2 -2.54,-7.62; 3 0,-7.62; 4 2.54,-7.62; 5 5.08,-7.62; 6 5.08,7.62; 7 2.54,7.62; 8 0,7.62; 9 -2.54,7.62; 10 -5.08,7.62
0204/5 = drill 0.813 octagon: 1 -2.54,0; 2 2.54,0
TACTILE-PTH = drill 1.016 pad 1.88: 1 -3.251,2.261; 2 3.251,2.261; 3 -3.251,-2.261; 4 3.251,-2.261

### Placement (x,y rotation side)
C1  106.68,51.56 270 top
C2  52.32,37.08 270 top
C3  126.75,22.61 270 top
C4  25.15,37.34 270 top
C5  106.93,37.08 270 top
C6  115.57,22.86 270 top
C7  25.15,52.32 270 top
C8  79.5,37.08 270 top
C9  104.39,23.11 270 top
C10  52.32,52.07 270 top
C11  79.5,52.32 270 top
C12  93.22,23.11 270 top
C13  88.39,26.16 0 top
C14  71.63,26.16 0 top
C15  54.61,26.16 0 top
C16  34.04,26.16 0 top
C17  9.14,20.32 0 top
C18  19.81,47.24 90 top
IC1  120.4,37.08 0 top
IC2  120.4,52.07 0 top
IC3  93.22,37.08 0 top
IC4  93.22,52.07 0 top
IC5  66.04,37.08 0 top
IC6  66.04,52.07 0 top
IC7  38.86,37.08 0 top
IC8  38.86,52.07 0 top
IC9  48.51,16 270 top
IC10  82.04,16 90 top
IC11  65.53,16 270 top
IC12  27.94,16 270 top
JP1  8.13,42.67 90 top
LED1  124.21,73.15 0 top
LED2  97.03,73.15 0 top
LED3  69.85,73.15 0 top
LED4  42.67,73.15 0 top
R1  112.52,76.71 0 top
R2  112.52,74.17 0 top
R3  112.52,71.63 0 top
R4  112.52,69.09 0 top
R5  112.52,66.55 0 top
R6  112.52,81.79 0 top
R7  112.52,79.25 0 top
R8  112.52,64.01 180 top
R9  85.09,76.71 0 top
R10  85.09,74.17 0 top
R11  85.09,71.63 0 top
R12  85.09,69.09 0 top
R13  85.09,66.55 0 top
R14  85.09,81.79 0 top
R15  85.09,79.25 0 top
R16  85.09,64.01 180 top
R17  57.91,76.71 0 top
R18  57.91,74.17 0 top
R19  57.91,71.63 0 top
R20  57.91,69.09 0 top
R21  57.91,66.8 0 top
R22  57.91,81.79 0 top
R23  57.91,79.25 0 top
R24  57.91,64.26 180 top
R25  30.73,76.71 0 top
R26  30.73,74.17 0 top
R27  30.73,71.63 0 top
R28  30.73,69.09 0 top
R29  30.73,66.55 0 top
R30  30.73,81.79 0 top
R31  30.73,79.25 0 top
R32  30.73,64.01 180 top
R33  130.56,21.84 270 top
R34  119.38,21.84 270 top
R35  108.2,22.1 270 top
R36  97.03,22.35 270 top
R37  19.81,40.13 90 top
S1  128.27,13.21 90 top
S2  117.09,13.21 90 top
S3  105.92,13.21 90 top
S4  94.74,13.21 90 top

### Tracks (layer width: path | path; a pad name or v marks a point on that pad's centre or on a via)
BUTTON0  (via drill 0.51)
  Top 0.254: v18.8,7.62 19.81,6.6 25.91,6.6 27.94,8.64 27.94,12.95 28.45,13.46 IC12.10
  Bottom 0.254: C3.2 126.75,20.57 128.02,19.3 R33.2 130.53,19.28 S1.4 S1.3 126.16,5.59 20.83,5.59 v18.8,7.62
BUTTON1  (via drill 0.51)
  Top 0.254: v13.97,30.48 v13.97,13.46
  Bottom 0.254: v13.97,30.48 19.3,25.15 26.92,25.15 28.19,23.88 28.19,22.1 29.21,21.08 IC12.13 | v13.97,13.46 14.48,13.46 21.84,6.1 115.49,6.1 S2.3 S2.4 119.36,19.28 R34.2 117.09,19.3 115.57,20.83 C6.2
BUTTON2  (via drill 0.51)
  Top 0.254: v15.24,24.64 v15.24,14.48
  Bottom 0.254: v15.24,24.64 18.8,21.08 IC12.2 | v15.24,14.48 15.24,13.46 22.1,6.6 104.83,6.6 S3.3 S3.4 108.18,19.53 R35.2 105.66,19.56 104.39,20.83 C9.2
BUTTON3
  Bottom 0.254: C12.2 93.22,21.08 94.49,19.81 R36.2 97,19.79 S4.4 S4.3 94.16,7.11 28.45,7.11 27.94,7.62 27.94,12.7 27.18,13.46 IC12.5
DK0
  Top 0.254: IC1.2 114.05,30.73 111.51,28.19 41.15,28.19 38.1,25.15 38.1,12.19 34.29,8.38 IC12.8
DK1
  Top 0.254: IC3.2 86.87,30.99 84.58,28.7 40.89,28.7 37.59,25.4 37.59,17.27 36.32,16 IC12.11
DK2
  Top 0.254: IC5.2 59.69,31.24 58.17,29.72 21.59,29.72 17.78,25.91 17.78,20.07 19.3,18.54 IC12.3
DK3
  Top 0.254: IC7.2 32.51,31.5 31.5,30.48 21.59,30.48 17.27,26.16 17.27,14.22 20.57,10.92 IC12.6
DKIN0
  Bottom 0.254: JP1.17 11.94,51.56 13.72,49.78 13.72,33.27 18.03,28.96 36.07,28.96 40.13,24.89 40.13,13.72 37.34,10.92 IC12.9
DKIN1
  Bottom 0.254: JP1.13 11.43,46.48 13.21,44.7 13.21,33.02 17.78,28.45 35.81,28.45 39.62,24.64 39.62,20.57 37.59,18.54 IC12.12
DKIN2
  Bottom 0.254: JP1.9 11.18,41.4 12.7,39.88 12.7,29.97 19.05,23.62 IC12.1
DKIN3
  Bottom 0.254: JP1.5 11.43,36.32 12.19,35.56 12.19,24.89 21.08,16 IC12.4
DKRESET
  Top 0.254: IC10.2 83.31,10.92 82.04,12.19 82.04,21.08 | 82.04,21.08 82.04,26.67 81.03,27.69 41.4,27.69 38.61,24.89 38.61,22.1 39.62,21.08 IC9.2 47.75,21.08 49.02,19.81 49.02,12.45 47.5,10.92 IC9.6 42.42,10.92 37.59,6.1 18.8,6.1 12.7,12.19 12.7,32.77 11.68,33.78 JP1.3 | 84.33,21.08 IC10.6 82.04,21.08
GND
  pour Top (isolate 0.305): 0.76,84.84 133.35,84.84 133.35,0.51 0.76,0.51
N$1
  Bottom 0.254: IC9.12 54.86,18.54 57.4,21.08 IC11.2
N$2
  Bottom 0.254: IC9.9 55.12,10.92 57.66,13.46 IC11.5
N$3
  Bottom 0.254: R1.1 106.43,76.71 105.16,75.44 105.16,62.23 107.19,60.2 118.11,60.2 119.13,59.18 IC2.13
N$4
  Bottom 0.254: R2.1 107.7,74.17 105.66,72.14 105.66,62.48 107.44,60.71 120.9,60.71 121.67,59.94 IC2.12
N$5
  Bottom 0.254: R3.1 108.46,71.63 106.17,69.34 106.17,62.74 107.7,61.21 123.44,61.21 124.21,60.45 IC2.11
N$6
  Bottom 0.254: R4.1 108.2,69.09 106.68,67.56 106.68,62.99 107.95,61.72 125.73,61.72 126.75,60.71 IC2.10
N$7
  Bottom 0.254: R5.1 108.2,66.55 107.19,65.53 107.19,63.25 108.2,62.23 128.02,62.23 129.29,60.96 IC2.9
N$8
  Bottom 0.254: R6.1 106.68,81.79 104.14,79.25 104.14,61.72 106.68,59.18 113.28,59.18 114.05,58.42 IC2.15
N$9
  Bottom 0.254: R7.1 106.43,79.25 104.65,77.47 104.65,61.98 106.93,59.69 115.57,59.69 116.59,58.67 IC2.14
N$10
  Bottom 0.254: IC1.14 116.59,38.86 118.36,37.08 131.32,37.08 133.1,38.86 133.1,42.67 131.57,44.2 128.52,44.2 126.75,45.97 IC2.7
N$11
  Bottom 0.254: IC1.13 119.13,42.93 118.11,43.94 113.03,43.94 111.51,45.47 IC2.1
N$12
  Bottom 0.254: IC1.12 121.67,43.94 120.9,44.7 115.06,44.7 114.05,45.72 IC2.2
N$13
  Bottom 0.254: IC1.11 IC2.6
N$14
  Top 0.254: R1.2 122.68,76.71 LED1.7
N$15
  Top 0.254: R2.2 122.68,74.17 LED1.6
N$16
  Top 0.254: R3.2 123.7,71.63 126.75,68.58 LED1.4
N$17
  Top 0.254: R4.2 120.9,69.09 121.67,68.33 LED1.2
N$18
  Top 0.254: R5.2 118.11,66.55 LED1.1
N$19
  Top 0.254: R6.2 116.08,81.79 117.35,83.06 120.9,83.06 121.67,82.3 LED1.9
N$20
  Top 0.254: R7.2 117.6,79.25 LED1.10
N$21
  Top 0.254: R8.1 116.33,64.01 117.35,62.99 128.52,62.99 129.29,63.75 LED1.5
N$22
  Bottom 0.254: IC3.14 89.41,38.61 90.93,37.08 103.12,37.08 105.41,39.37 105.41,43.18 104.14,44.45 100.84,44.45 99.57,45.72 IC4.7
N$23
  Bottom 0.254: IC3.13 91.95,43.18 91.19,43.94 85.6,43.94 84.33,45.21 IC4.1
N$24
  Bottom 0.254: IC3.12 94.49,43.43 93.22,44.7 88.39,44.7 86.87,46.23 IC4.2
N$25
  Bottom 0.254: IC11.10 IC10.12
N$26
  Bottom 0.254: IC3.11 IC4.6
N$27
  Bottom 0.254: IC11.13 IC10.9
N$30
  Bottom 0.254: R9.1 79.5,76.71 77.98,75.18 77.98,62.23 80.26,59.94 90.42,59.94 91.95,58.42 IC4.13
N$31
  Bottom 0.254: R10.1 80.01,74.17 78.49,72.64 78.49,62.48 80.52,60.45 92.71,60.45 94.49,58.67 IC4.12
N$32
  Bottom 0.254: R11.1 81.53,71.63 78.99,69.09 78.99,62.74 80.77,60.96 95,60.96 97.03,58.93 IC4.11
N$33
  Bottom 0.254: R12.1 81.28,69.09 79.5,67.31 79.5,62.99 81.03,61.47 97.79,61.47 99.57,59.69 IC4.10
N$34
  Bottom 0.254: R13.1 81.03,66.55 80.01,65.53 80.01,63.25 81.28,61.98 100.58,61.98 102.11,60.45 IC4.9
N$35
  Bottom 0.254: R14.1 80.01,81.79 76.96,78.74 76.96,61.72 79.76,58.93 85.6,58.93 86.87,57.66 IC4.15
N$36
  Bottom 0.254: R15.1 78.99,79.25 77.47,77.72 77.47,61.98 80.01,59.44 87.63,59.44 89.41,57.66 IC4.14
N$37
  Top 0.254: R9.2 95.5,76.71 LED2.7
N$38
  Top 0.254: R10.2 95.5,74.17 LED2.6
N$39
  Top 0.254: R11.2 96.52,71.63 99.57,68.58 LED2.4
N$40
  Top 0.254: R12.2 93.47,69.09 94.49,68.07 LED2.2
N$41
  Top 0.254: R13.2 90.42,66.55 91.44,65.53 LED2.1
N$42
  Top 0.254: R14.2 88.65,81.79 89.92,83.06 93.73,83.06 94.49,82.3 LED2.9
N$43
  Top 0.254: R15.2 90.42,79.25 LED2.10
N$44
  Top 0.254: R16.1 89.41,64.01 90.42,62.99 101.35,62.99 102.11,63.75 LED2.5
N$45
  Bottom 0.254: IC5.14 62.23,39.12 64.26,37.08 76.96,37.08 77.98,38.1 77.98,43.43 77.22,44.2 73.41,44.2 72.39,45.21 IC6.7
N$46
  Bottom 0.254: IC5.13 64.77,43.18 64.26,43.69 58.67,43.69 57.15,45.21 IC6.1
N$47
  Bottom 0.254: IC5.12 67.31,43.69 66.55,44.45 60.96,44.45 59.69,45.72 IC6.2
N$48
  Bottom 0.254: IC6.6 IC5.11
N$52
  Bottom 0.254: R17.1 53.85,76.71 51.31,74.17 51.31,62.23 53.34,60.2 63.25,60.2 64.77,58.67 IC6.13
N$53
  Bottom 0.254: R18.1 53.59,74.17 51.82,72.39 51.82,62.48 53.59,60.71 65.79,60.71 67.31,59.18 IC6.12
N$54
  Bottom 0.254: R19.1 53.59,71.63 52.32,70.36 52.32,62.74 53.85,61.21 68.33,61.21 69.85,59.69 IC6.11
N$55
  Bottom 0.254: R20.1 53.59,69.09 52.83,68.33 52.83,62.99 54.1,61.72 70.36,61.72 72.39,59.69 IC6.10
N$56
  Bottom 0.254: R21.1 53.85,66.8 53.34,66.29 53.34,63.25 54.36,62.23 72.64,62.23 74.93,59.94 IC6.9
N$57
  Bottom 0.254: R22.1 52.32,81.79 50.29,79.76 50.29,61.72 52.83,59.18 58.42,59.18 59.69,57.91 IC6.15
N$58
  Bottom 0.254: R23.1 52.83,79.25 50.8,77.22 50.8,61.98 53.09,59.69 61.21,59.69 62.23,58.67 IC6.14
N$59
  Top 0.254: R17.2 70.36,76.71 72.39,78.74 LED3.7
N$60
  Top 0.254: R18.2 70.36,74.17 74.93,78.74 LED3.6
N$61
  Top 0.254: R19.2 69.09,71.63 72.39,68.33 LED3.4
N$62
  Top 0.254: R20.2 65.79,69.09 67.31,67.56 LED3.2
N$63
  Top 0.254: R21.2 62.74,66.8 64.01,65.53 LED3.1
N$64
  Top 0.254: R22.2 61.72,81.79 62.99,83.06 66.55,83.06 67.31,82.3 LED3.9
N$65
  Top 0.254: R23.2 63.25,79.25 LED3.10
N$66
  Top 0.254: R24.1 61.98,64.26 63.25,62.99 74.17,62.99 74.93,63.75 LED3.5
N$67
  Bottom 0.254: IC7.14 35.05,38.35 36.07,37.34 48.26,37.34 50.55,39.62 50.55,43.18 49.53,44.2 46.48,44.2 45.21,45.47 IC8.7
N$68
  Bottom 0.254: IC7.13 37.59,42.93 37.34,43.18 31.75,43.18 29.97,44.96 IC8.1
N$69
  Bottom 0.254: IC7.12 40.13,43.43 39.37,44.2 34.04,44.2 32.51,45.72 IC8.2
N$70
  Bottom 0.254: IC7.11 IC8.6
N$74
  Bottom 0.254: R25.1 26.67,76.71 23.62,73.66 23.62,62.23 25.91,59.94 36.07,59.94 37.59,58.42 IC8.13
N$75
  Bottom 0.254: R26.1 27.18,74.17 24.13,71.12 24.13,62.48 26.16,60.45 38.86,60.45 40.13,59.18 IC8.12
N$76
  Bottom 0.254: R27.1 27.43,71.63 24.64,68.83 24.64,62.74 26.42,60.96 40.89,60.96 42.67,59.18 IC8.11
N$77
  Bottom 0.254: R28.1 26.92,69.09 25.15,67.31 25.15,62.99 26.67,61.47 42.93,61.47 45.21,59.18 IC8.10
N$78
  Bottom 0.254: R29.1 26.16,66.55 25.65,66.04 25.65,63.25 26.92,61.98 45.72,61.98 47.75,59.94 IC8.9
N$79
  Bottom 0.254: R30.1 25.65,81.79 22.61,78.74 22.61,61.72 25.4,58.93 31.24,58.93 32.51,57.66 IC8.15
N$80
  Bottom 0.254: R31.1 26.16,79.25 23.11,76.2 23.11,61.98 25.65,59.44 34.04,59.44 35.05,58.42 IC8.14
N$81
  Top 0.254: R25.2 42.93,76.71 45.21,78.99 LED4.7
N$82
  Top 0.254: R26.2 43.18,74.17 47.75,78.74 LED4.6
N$83
  Top 0.254: R27.2 41.66,71.63 45.21,68.07 LED4.4
N$84
  Top 0.254: R28.2 38.35,69.09 40.13,67.31 LED4.2
N$85
  Top 0.254: R29.2 35.56,66.55 36.58,65.53 LED4.1
N$86
  Top 0.254: R30.2 34.29,81.79 35.56,83.06 39.62,83.06 40.13,82.55 LED4.9
N$87
  Top 0.254: R31.2 36.07,79.25 LED4.10
N$88
  Top 0.254: R32.1 34.8,64.01 35.81,62.99 46.99,62.99 47.75,63.75 LED4.5
PULSES
  Top 0.254: 65.53,16 65.53,18.54 | IC11.12 65.53,18.54 | IC11.4 65.53,16 | JP1.4 5.59,33.78 5.08,33.27 5.08,19.05 18.54,5.59 57.15,5.59 58.17,6.6 58.17,22.1 59.69,23.62 IC11.1 64.26,23.62 65.53,22.35 65.53,18.54 | IC11.9 67.06,10.92 65.53,12.45 65.53,16
RESET
  Top 0.254: IC1.1 105.66,33.27 102.62,36.32 86.11,36.32 84.33,34.54 IC3.1 78.23,33.27 75.18,36.32 59.69,36.32 57.15,33.78 IC5.1 51.05,33.27 48.26,36.07 31.5,36.07 29.97,34.54 IC7.1 29.97,31.75 29.46,31.24 18.8,31.24 16,34.04 16,44.45 17.53,45.97 C18.1 R37.2
VCC
  pour Bottom (isolate 0.305): 0.76,84.84 133.35,84.84 133.35,0.51 0.76,0.51
ZC0
  Top 0.254: R8.2 109.98,47.24 114.05,43.18 IC1.15
  Bottom 0.254: IC1.15 114.05,38.35 112.78,37.08 110.24,37.08 109.73,36.58 109.73,33.78 105.66,29.72 94.49,29.72 91.44,26.67 91.44,20.32 89.66,18.54 IC10.5
ZC1
  Top 0.254: R16.2 82.55,46.99 86.87,42.67 IC3.15
  Bottom 0.254: IC3.15 86.87,38.61 85.34,37.08 82.3,37.08 82.04,36.83 82.04,10.41 84.07,8.38 IC10.1
ZC2
  Top 0.254: R24.2 55.37,46.99 59.69,42.67 IC5.15
  Bottom 0.254: IC5.15 59.69,38.35 58.42,37.08 55.63,37.08 54.86,36.32 54.86,32.51 53.34,30.99 50.8,30.99 49.02,29.21 49.02,15.49 46.99,13.46 IC9.5
ZC3
  Top 0.254: R32.2 28.19,46.74 32.51,42.42 IC7.15
  Bottom 0.254: IC7.15 32.51,38.61 31.24,37.34 27.94,37.34 27.18,36.58 27.18,32.51 30.23,29.46 36.32,29.46 42.16,23.62 IC9.1
ZCOUT0
  Top 0.254: JP1.18 5.59,51.56 3.05,49.02 3.05,18.03 17.53,3.56 72.14,3.56 74.17,5.59 74.17,14.22 72.39,16 IC11.11
ZCOUT1
  Top 0.254: JP1.14 5.59,46.48 3.56,44.45 3.56,18.29 17.78,4.06 67.06,4.06 69.34,6.35 IC11.8
ZCOUT2
  Top 0.254: JP1.10 5.59,41.4 4.06,39.88 4.06,18.54 18.03,4.57 57.66,4.57 59.18,6.1 59.18,9.91 60.2,10.92 IC11.6
ZCOUT3
  Top 0.254: JP1.6 5.59,36.32 4.57,35.31 4.57,18.8 18.29,5.08 57.4,5.08 58.67,6.35 58.67,17.27 59.94,18.54 IC11.3